# Altium project Pedal Board v0.1.PrjPCB
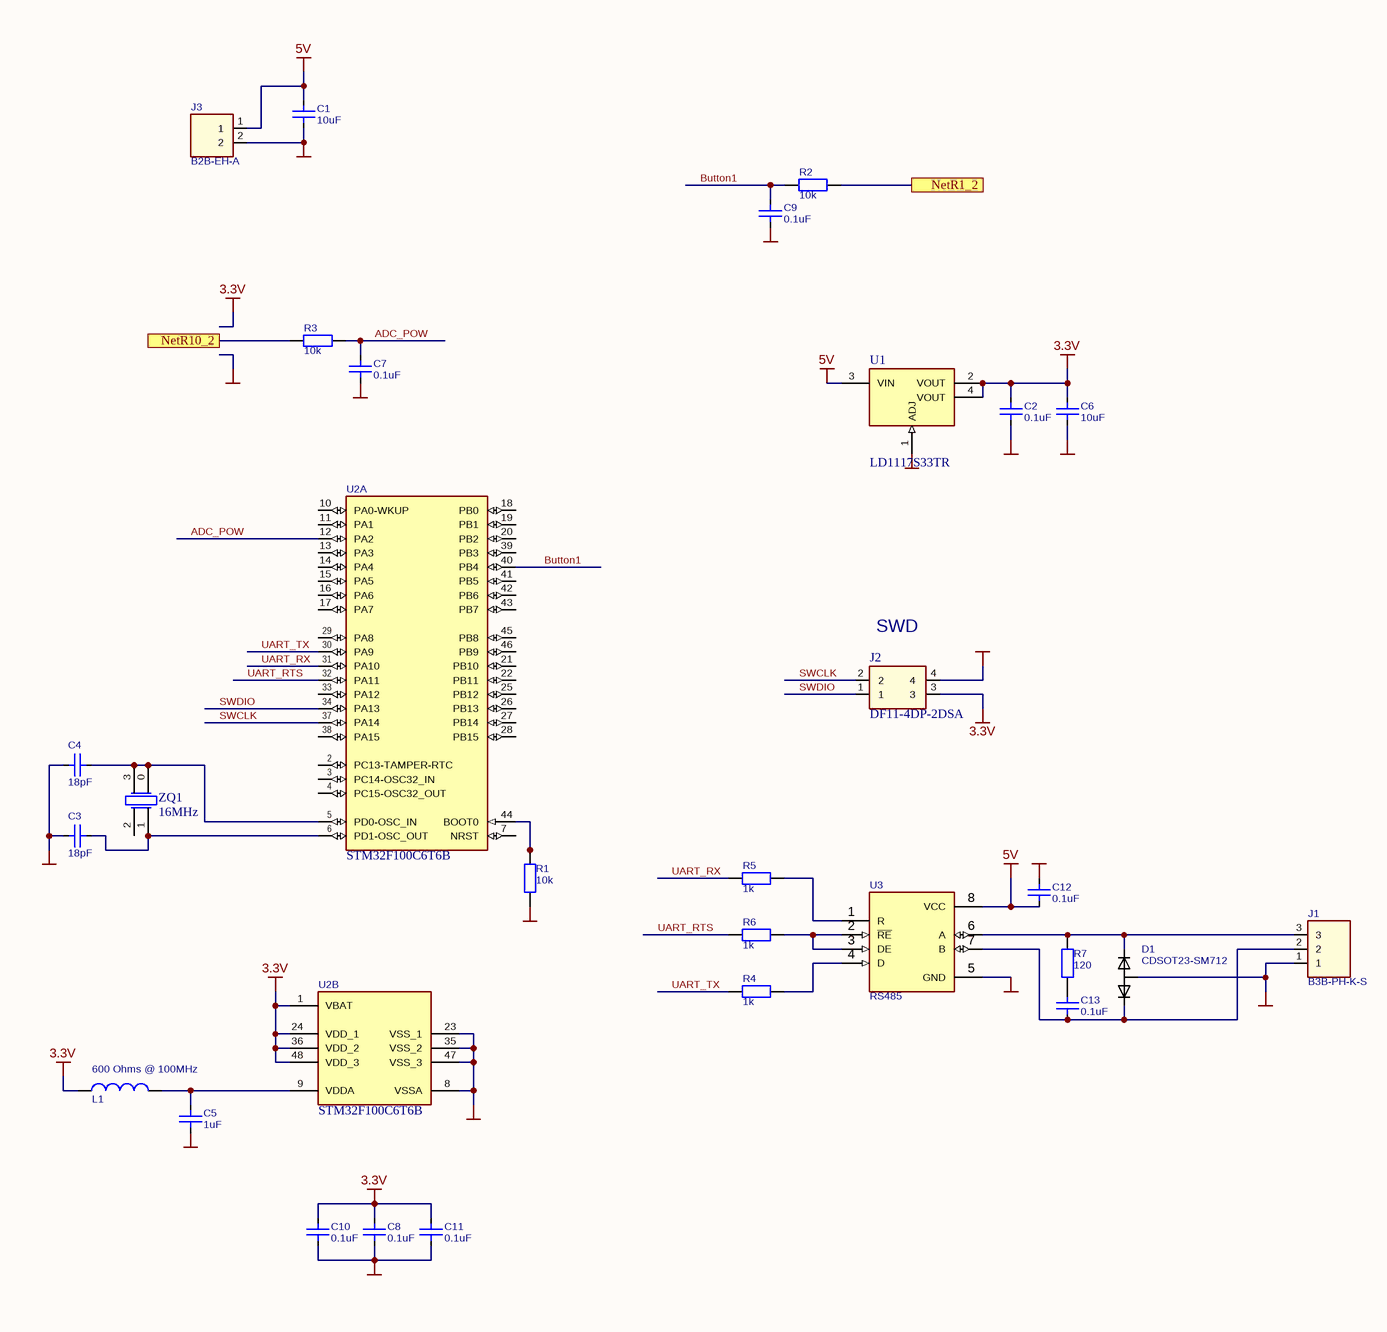
[diagram p0: Pedal Board v0.1.SchDoc]
1 sheet, 29 parts. Net scope: flat (ports and power ports of the same name join across sheets).
Board file: Pedal Board v0.1.PcbDoc

## Sheet Pedal Board v0.1.SchDoc
size A3; PageSetup: Record=PageOptions|CenterHorizontal=True|CenterVertical=True|PrintScale=1.04|XCorrection=1.00|YCorrection=1.00|PrintKind=0|BorderSize=5000000|LeftOffset=0|BottomOffset=0|Orientation=2|PaperLength=1000|PaperWidth=1000|Scale=100|PaperSource=15|PrintQuality=1200|MediaType=1|DitherType=10|PaperKind=A3|PrintScaleMode=1

### Parts
C1  10uF  [CAPC3216N]
C2  0.1uF  [CAPC1608N]
C3  18pF  [CAPC1608N]
C4  18pF  [CAPC1608N]
C5  1uF  [CAPC1608N]
C6  10uF  [CAPC3216N]
C7  0.1uF  [CAPC1608N]
C8  0.1uF  [CAPC1608N]
C9  0.1uF  [CAPC1608N]
C10  0.1uF  [CAPC1608N]
C11  0.1uF  [CAPC1608N]
C12  0.1uF  [CAPC1608N]
C13  0.1uF  [CAPC1608N]
D1  CDSOT23-SM712  [SOT23-3N]
J1  B3B-PH-K-S  [B3B-PH-K-S]
J2  DF11-4DP-2DSA  [DF11-4DP-2DSA]
J3  B2B-EH-A  [B2B-EH-A]
L1  600 Ohms @ 100MHz  [INDC2012N]
R1  10k  [RESC1608N]
R2  10k  [RESC1608N]
R3  10k  [RESC1608N]
R4  1k  [RESC1608N]
R5  1k  [RESC1608N]
R6  1k  [RESC1608N]
R7  120  [RESC1608N]
U1  LD1117S33TR  [SOT223-4N]
U2  STM32F100C6T6B  [STM-LQFP48_N]  (parts A,B of 2)
U3  RS485  [SOIC127P600-8AN]
ZQ1  16MHz  [q3225]

### Ports
NetR1_2, NetR10_2

### Nets
3.3V: C2.1 C6.2 C8.2 C10.2 C11.2 J2.3 L1.1 U1.2(VOUT) U1.4(VOUT) U2.1(VBAT) U2.24(VDD_1) U2.36(VDD_2) U2.48(VDD_3)
5V: C1.2 C12.1 J3.1 U1.3(VIN) U3.8(VCC)
GND: C1.1 C2.2 C3.1 C4.1 C5.1 C6.1 C7.1 C8.1 C9.1 C10.1 C11.1 C12.2 D1.3 J1.1 J2.4 J3.2 R1.1 U1.1(ADJ) U2.8(VSSA) U2.23(VSS_1) U2.35(VSS_2) U2.47(VSS_3) U3.5(GND)
ADC_POW: C7.2 R3.1 U2.12(PA2)
Button1: C9.2 R2.1 U2.40(PB4)
SWCLK: J2.2 U2.37(PA14)
SWDIO: J2.1 U2.34(PA13)
UART_RTS: R6.1 U2.32(PA11)
UART_RX: R5.1 U2.31(PA10)
UART_TX: R4.1 U2.30(PA9)
NetC3_2: C3.2 U2.6(PD1-OSC_OUT) ZQ1.1(OSC2)
NetC4_2: C4.2 U2.5(PD0-OSC_IN) ZQ1.0(OSC1) ZQ1.3(OSC1)
NetC5_2: C5.2 L1.2 U2.9(VDDA)
NetC13_1: C13.1 D1.1 J1.2 U3.7(B)
NetC13_2: C13.2 R7.1
NetD1_2: D1.2 J1.3 R7.2 U3.6(A)
NetR1_2: R1.2 U2.44(BOOT0)
NetR2_2: R2.2 ; port NetR1_2
NetR3_2: R3.2 ; port NetR10_2
NetR4_2: R4.2 U3.4(D)
NetR5_2: R5.2 U3.1(R)
NetR6_2: R6.2 U3.2(~{RE}) U3.3(DE)

Not connected (* = marked no-connect by the designer): U2 2(PC13-TAMPER-RTC) 3(PC14-OSC32_IN) 4(PC15-OSC32_OUT) 7(NRST) 10(PA0-WKUP) 11(PA1) 13(PA3) 14(PA4) 15(PA5) 16(PA6) 17(PA7) 18(PB0) 19(PB1) 20(PB2) 21(PB10) 22(PB11) 25(PB12) 26(PB13) 27(PB14) 28(PB15) 29(PA8) 33(PA12) 38(PA15) 39(PB3) 41(PB5) 42(PB6) 43(PB7) 45(PB8) 46(PB9); ZQ1 2(OSC2)

### Notes on the sheet
- (near J2) SWD

### Library data of the parts
C1 C6 = Cap 3216 (1206): Capacitor; Value: 22uF
C2-C5 C7-C13 = Cap 1608 (0603): Capacitor; Value: 100pF
D1 = CDSOT23-SM712: TVS DIODE 7V/12V 14V/26V SOT23-3
J1 = B3B-PH-K-S: B3B-PH-K-S (JST 2mm)
J3 = B2B-EH-A: B2B-EH-A (JST 2.54mm)
L1 = BLM21A: Chip Ferrite Bead BLM21A; Value: 600 Ohms @ 100MHz
R1-R7 = Res 1608 (0603): Resistor 1608 (0603); Value: 33
U1 = LM1117MPX-ADJ: Single Output LDO, 800 mA, Adjustable 1.5 to 13.5 V Output, 3.8 to 15 V Input, with Internal Current Limiting, 4-pin SOT-223 (DCY), -40 to 125 degC, Green (RoHS & no Sb/Br); Manufacturer: Texas Instruments; PartNumber: REG1117; Iout(Max)(A): 0.8; Iq(Typ)(mA): 4; Rating: Catalog; SubFamily: Single Channel LDO; Vdo(Typ)(mV): 1100; Vin(Max)(V): 15; Vin(Min)(V): 3.8; Vout Adj(Max)(V): 13.5; Vout Adj(Min)(V): 1.25; DatasheetVersion: SBVS001D; PackageVersion: 4202506/B; PackageReference: DCY4; PackageDescription: 4-Pin Plastic Small Outline, Body 3.5 x 6.5 mm, Pitch 2.3 mm; Supplier 1: Digi-Key; Supplier Part Number 1: REG1117-ND; Supplier 2: Farnell; Supplier Part Number 2: 1097566; Supplier 3: Newark; Supplier Part Number 3: 14P6981; Supplier 4: Mouser; Supplier Part Number 4: 595-REG1117; Eco-Plan: Green (RoHS & no Sb/Br); Mounting Technology: Surface Mount; Code_JEDEC: TO-261; ComponentLink1Description: Manufacturer URL; ComponentLink1URL: http://www.ti.com/; ComponentLink2Description: Datasheet; ComponentLink2URL: http://www.ti.com/general/docs/lit/getliterature.tsp?genericPartNumber=REG1117&fileType=pdf; ComponentLink3Description: Package Specification; ComponentLink3URL: http://www.ti.com/litv/pdf/mpds094a
U2 = STM32F100C6T6B: ARM Cortex-M3 32-bit MCU, 32 KB Flash, 4 KB Internal RAM, 37 I/Os, 48-pin LQFP, -40 to 85 degC, Tray; A/D Converter: 1x12-bit (10 Channel); D/A Converter: 2x12-bit (2 Channel); FLASH Size (Prog) (kB): 32; I/Os (High Current): 37; Internal RAM Size (kB): 4; Operating Frequency(F) (Processor speed) (MHz): 24; Supply Voltage(Vcc) min (V): 2; DatasheetVersion: Rev. 7; PackageVersion: Rev. 6, 06/2013; PackageReference: LQFP48; PackageDescription: 48-Pin Low Profile Quad Flat Package, 7 x 7 mm Body, 0.5 mm Pitch; Supplier 1: Digi-Key; Supplier Part Number 1: 497-10500-ND; Supplier 2: Farnell; Supplier Part Number 2: 1838510; Supplier 3: Newark; Supplier Part Number 3: 86R1310; Supplier 4: Newark; Supplier Part Number 4: 76R0987; Supplier 5: Mouser; Supplier Part Number 5: 511-STM32F100C6T6B; Core: ARM Cortex-M3; Packing: Tray; Mounting Technology: Surface Mount; PartNumber: STM32F100C6T6B; ComponentLink1Description: Manufacturer URL; ComponentLink1URL: http://www.st.com/web/en/home.html; ComponentLink2Description: Datasheet; ComponentLink2URL: http://www.st.com/st-web-ui/static/active/en/resource/technical/document/datasheet/CD00251732.pdf; ComponentLink3Description: Package Specification; ComponentLink3URL: http://www.st.com/st-web-ui/static/active/en/resource/technical/document/datasheet/DM00058181.pdf
U3 = SN65HVD22D: Extended Common-mode RS-485 Transceiver, 0.5 Mbps, 5 V, Half Duplex, -40 to 85 degC, 8-pin SOIC, Pb-Free (RoHS); Manufacturer: Texas Instruments; PartNumber: SN65HVD22P
ZQ1 = NX3225-4